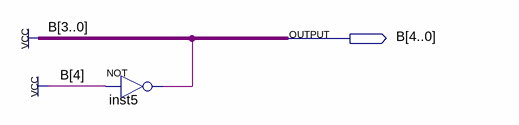
[diagram p0: schematic sheet]
// Quartus schematic CONST2.bdf as structural Verilog: 1 symbols, 1 pins
module CONST2 (
  output [4:0] B
);

  wire inst5_out;

  not inst5 (inst5_out, 1'b1);

  assign B = {5{1'b1}};
endmodule
